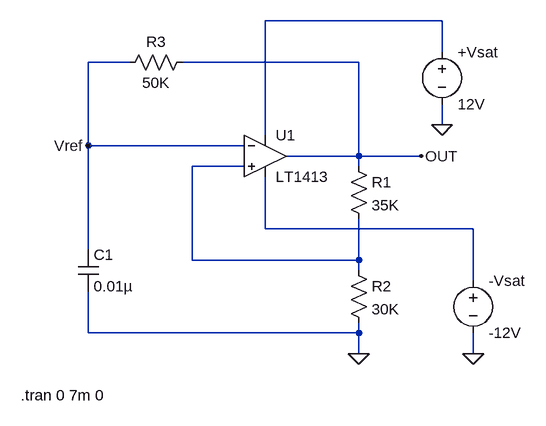
[diagram p0: schematic OPAMP_Astable_Multistabrator.asc]
OPAMP_Astable_Multistabrator.asc, the LTspice schematic file:
Version 4
SHEET 1 880 680
WIRE 480 -48 208 -48
WIRE 480 0 480 -48
WIRE 0 16 -64 16
WIRE 352 16 80 16
WIRE 480 112 480 80
WIRE 208 128 208 -48
WIRE -64 144 -64 16
WIRE 176 144 -64 144
WIRE 352 160 352 16
WIRE 352 160 240 160
WIRE 448 160 352 160
WIRE 176 176 96 176
WIRE 352 176 352 160
WIRE 208 272 208 192
WIRE 528 272 208 272
WIRE -64 304 -64 144
WIRE 96 320 96 176
WIRE 352 320 352 256
WIRE 352 320 96 320
WIRE 352 336 352 320
WIRE 528 352 528 272
WIRE -64 432 -64 368
WIRE 352 432 352 416
WIRE 352 432 -64 432
WIRE 352 464 352 432
WIRE 528 464 528 432
FLAG 352 464 0
FLAG 480 112 0
FLAG 528 464 0
FLAG 448 160 OUT
FLAG -64 144 Vref
SYMBOL OpAmps\\LT1413 208 96 R0
SYMATTR InstName U1
SYMBOL res 336 160 R0
SYMATTR InstName R1
SYMATTR Value 35K
SYMBOL res 336 320 R0
SYMATTR InstName R2
SYMATTR Value 30K
SYMBOL cap -80 304 R0
SYMATTR InstName C1
SYMATTR Value 0.01µ
SYMBOL res 96 0 R90
WINDOW 0 0 56 VBottom 2
WINDOW 3 32 56 VTop 2
SYMATTR InstName R3
SYMATTR Value 50K
SYMBOL voltage 480 -16 R0
SYMATTR InstName +Vsat
SYMATTR Value 12V
SYMBOL voltage 528 336 R0
SYMATTR InstName -Vsat
SYMATTR Value -12V
TEXT -168 528 Left 2 !.tran 0 7m 0

The netlist it stands for:
* OPAMP_Astable_Multistabrator.asc
XU1 N002 Vref N001 N003 OUT LT1413  ; pins In+ In- V+ V- OUT
R1 OUT N002 35K
R2 N002 0 30K
C1 Vref 0 0.01µ
R3 OUT Vref 50K
V§+Vsat N001 0 12V
V§-Vsat N003 0 -12V
.tran 0 7m 0
.lib LTC.lib
.backanno
.end